# Altium schematic sheet TOP.SchDoc
size A; SheetNumber: 1; SheetTotal: 1
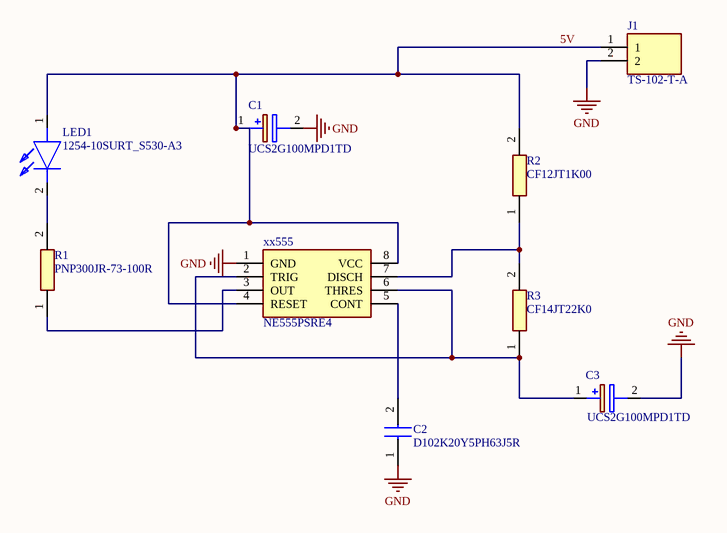
[diagram p0: TOP.SchDoc]

## Parts
C1  UCS2G100MPD1TD  [CAPPRD500W60D1025H2150]
C2  D102K20Y5PH63J5R  [D102K20Y5PH63J5R]
C3  UCS2G100MPD1TD  [CAPPRD500W60D1025H2150]
J1  TS-102-T-A  [SAMTEC_TS-102-T-A]
LED1  1254-10SURT_S530-A3  [125410SURTS530A3]
R1  PNP300JR-73-100R  [RESAD2990W85L1150D460]
R2  CF12JT1K00  [RESAD1930W63L850D270]
R3  CF14JT22K0  [RESAD1520W63L600D230]
xx555  NE555PSRE4  [SOIC127P780X200-8N]

## Nets
GND: C1.2(-) C2.1 C3.2(-) J1.2 xx555.1(GND)
5V: C1.1(+) J1.1 LED1.1(A) R2.2 xx555.4(RESET) xx555.8(VCC)
NetC2_2: C2.2 xx555.5(CONT)
NetC3_1: C3.1(+) R3.1 xx555.2(TRIG) xx555.6(THRES)
NetLED1_2: LED1.2(K) R1.2
NetR1_1: R1.1 xx555.3(OUT)
NetR2_1: R2.1 R3.2 xx555.7(DISCH)

## Library data of the parts
C1 C3 = UCS2G100MPD1TD: Capacitor Polarised; Manufacturer_Name: Nichicon; Datasheet Link: http://nichicon-us.com/english/products/pdfs/e-ucs.pdf; Height: 21.5mm; Manufacturer_Part_Number: UCS2G100MPD1TD; Mouser Part Number: 647-UCS2G100MPD1TD; Mouser Price/Stock: https://www.mouser.co.uk/ProductDetail/Nichicon/UCS2G100MPD1TD?qs=qJYTfuAnAfodP803qrfaZA%3D%3D; Arrow Part Number: UCS2G100MPD1TD; Arrow Price/Stock: https://www.arrow.com/en/products/ucs2g100mpd1td/nichicon
C2 = D102K20Y5PH63J5R: Capacitor; Manufacturer_Name: Vishay; Datasheet Link: https://componentsearchengine.com/Datasheets/2/D102K20Y5PH63J5R.pdf; Height: 9mm; Manufacturer_Part_Number: D102K20Y5PH63J5R; Mouser Part Number: 594-D102K20Y5PH63J5R; Mouser Price/Stock: https://www.mouser.co.uk/ProductDetail/Vishay-BC-Components/D102K20Y5PH63J5R?qs=4byTeOu1NPHpy4BomGS2Ig%3D%3D; Arrow Part Number: D102K20Y5PH63J5R; Arrow Price/Stock: https://www.arrow.com/en/products/d102k20y5ph63j5r/vishay
J1 = TS-102-T-A: Connector; Manufacturer_Name: SAMTEC; Manufacturer_Part_Number: TS-102-T-A; Mouser Part Number: 200-TS102TA; Mouser Price/Stock: https://www.mouser.co.uk/ProductDetail/Samtec/TS-102-T-A?qs=0lQeLiL1qyYw%2F4U%252Bgf8JTQ%3D%3D; Arrow Part Number: TS-102-T-A; Arrow Price/Stock: https://www.arrow.com/en/products/ts-102-t-a/samtec?region=nac
LED1 = 1254-10SURT_S530-A3: LED; Manufacturer_Name: Everlight; Manufacturer_Part_Number: 1254-10SURT/S530-A3; Datasheet Link: https://datasheet.datasheetarchive.com/originals/distributors/Datasheets-3/DSA-55877.pdf; Height: 5.2mm; Arrow Part Number: 1254-10SURT/S530-A3; Arrow Price/Stock: https://www.arrow.com/en/products/1254-10surts530-a3/everlight-electronics?region=nac
R1 = PNP300JR-73-100R: Resistor; Manufacturer_Name: KEMET; Datasheet Link: https://www.yageo.com/upload/media/product/productsearch/datasheet/lr/YAGEO%20PNP_datasheet_2021v0.pdf; Manufacturer_Part_Number: PNP300JR-73-100R; Mouser Part Number: 603-PNP300JR-73-100R; Mouser Price/Stock: https://www.mouser.com/Search/Refine.aspx?Keyword=603-PNP300JR-73-100R; Arrow Part Number: PNP300JR-73-100R; Arrow Price/Stock: https://www.arrow.com/en/products/pnp300jr-73-100r/yageo
R2 = CF12JT1K00: Resistor; Manufacturer_Name: Stackpole Electronics; Datasheet Link: https://cs.seielect.com/catalog/SEI-CF_CFM.pdf; Manufacturer_Part_Number: CF12JT1K00; Mouser Part Number: 708-CF12JT1K00; Mouser Price/Stock: https://www.mouser.co.uk/ProductDetail/SEI-Stackpole/CF12JT1K00?qs=FESYatJ8odK%252BPjfs7xH%2FCA%3D%3D
R3 = CF14JT22K0: Resistor; Manufacturer_Name: Stackpole Electronics; Datasheet Link: https://cs.seielect.com/catalog/SEI-CF_CFM.pdf; Manufacturer_Part_Number: CF14JT22K0; Arrow Part Number: CF14JT22K0; Arrow Price/Stock: https://www.arrow.com/en/products/cf14jt22k0/stackpole-electronics
xx555 = NE555PSRE4: Integrated Circuit; Manufacturer_Name: Texas Instruments; Datasheet Link: http://www.ti.com/lit/ds/symlink/ne555.pdf; Height: 2mm; Manufacturer_Part_Number: NE555PSRE4; Mouser Part Number: 595-NE555PSRE4; Mouser Price/Stock: https://www.mouser.co.uk/ProductDetail/Texas-Instruments/NE555PSRE4?qs=rLYyFdxB%2FmqTKEcMFJ%252BBIw%3D%3D; Arrow Part Number: NE555PSRE4; Arrow Price/Stock: https://www.arrow.com/en/products/ne555psre4/texas-instruments